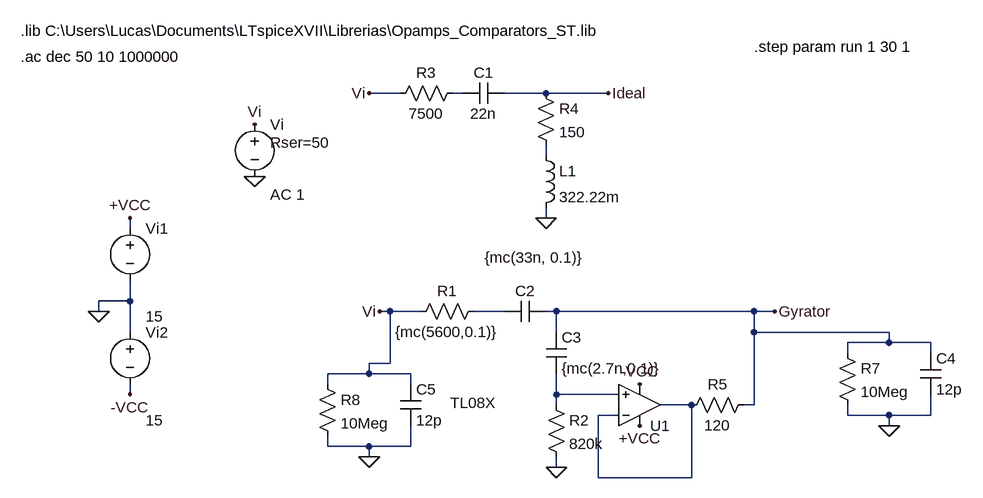
[diagram p0: schematic Pasaaltos.asc]
Pasaaltos.asc, the LTspice schematic file:
Version 4
SHEET 1 880 836
WIRE -96 144 -144 144
WIRE 0 144 -16 144
WIRE 128 144 64 144
WIRE 224 144 128 144
WIRE 128 240 128 224
WIRE 128 336 128 320
WIRE -512 352 -512 336
WIRE -512 464 -512 432
WIRE -512 464 -560 464
WIRE -560 480 -560 464
WIRE -112 480 -128 480
WIRE -64 480 -112 480
WIRE 64 480 16 480
WIRE 144 480 128 480
WIRE 448 480 144 480
WIRE 480 480 448 480
WIRE -512 512 -512 464
WIRE 144 512 144 480
WIRE 448 512 448 480
WIRE 656 512 448 512
WIRE 656 528 656 512
WIRE 656 528 592 528
WIRE 720 528 656 528
WIRE 592 544 592 528
WIRE 720 544 720 528
WIRE -112 560 -112 480
WIRE -112 560 -144 560
WIRE -144 576 -144 560
WIRE -144 576 -208 576
WIRE -80 576 -144 576
WIRE -208 592 -208 576
WIRE -80 592 -80 576
WIRE -512 608 -512 592
WIRE 144 608 144 576
WIRE 240 608 144 608
WIRE 144 624 144 608
WIRE 352 624 304 624
WIRE 448 624 448 512
WIRE 448 624 432 624
WIRE 240 640 208 640
WIRE 592 640 592 624
WIRE 656 640 592 640
WIRE 720 640 720 608
WIRE 720 640 656 640
WIRE 656 656 656 640
WIRE -208 688 -208 672
WIRE -144 688 -208 688
WIRE -80 688 -80 656
WIRE -80 688 -144 688
WIRE -144 704 -144 688
WIRE 144 720 144 704
WIRE 208 736 208 640
WIRE 352 736 352 624
WIRE 352 736 208 736
FLAG -320 192 Vi
FLAG -320 272 0
FLAG -512 336 +VCC
FLAG -512 608 -VCC
FLAG -560 480 0
FLAG 128 336 0
FLAG -144 144 Vi
FLAG 224 144 Ideal
FLAG -128 480 Vi
FLAG 144 720 0
FLAG 272 656 +VCC
FLAG 272 592 -VCC
FLAG 480 480 Gyrator
FLAG 656 656 0
FLAG -144 704 0
SYMBOL voltage -320 176 R0
WINDOW 123 24 124 Left 2
WINDOW 39 24 44 Left 2
SYMATTR Value2 AC 1
SYMATTR SpiceLine Rser=50
SYMATTR InstName Vi
SYMATTR Value ""
SYMBOL voltage -512 336 R0
WINDOW 3 24 152 Left 2
WINDOW 123 24 124 Left 2
WINDOW 39 0 0 Left 0
SYMATTR Value 15
SYMATTR InstName Vi1
SYMBOL voltage -512 496 R0
WINDOW 3 24 152 Left 2
WINDOW 123 24 124 Left 2
WINDOW 39 0 0 Left 0
SYMATTR Value 15
SYMATTR InstName Vi2
SYMBOL res 0 128 R90
WINDOW 0 0 56 VBottom 2
WINDOW 3 32 56 VTop 2
SYMATTR InstName R3
SYMATTR Value 7500
SYMBOL cap 64 128 R90
WINDOW 0 0 32 VBottom 2
WINDOW 3 32 32 VTop 2
SYMATTR InstName C1
SYMATTR Value 22n
SYMBOL res 112 128 R0
SYMATTR InstName R4
SYMATTR Value 150
SYMBOL ind 112 224 R0
SYMATTR InstName L1
SYMATTR Value 322.22m
SYMBOL cap 128 464 R90
WINDOW 0 0 32 VBottom 2
WINDOW 3 -83 18 VTop 2
SYMATTR InstName C2
SYMATTR Value {mc(33n, 0.1)}
SYMBOL cap 128 512 R0
SYMATTR InstName C3
SYMATTR Value {mc(2.7n,0.1)}
SYMBOL res 128 608 R0
SYMATTR InstName R2
SYMATTR Value 820k
SYMBOL Opamps\\opamp2 272 688 M180
WINDOW 3 -291 67 Left 2
SYMATTR Value TL08X
SYMATTR InstName U1
SYMBOL res 448 608 R90
WINDOW 0 0 56 VBottom 2
WINDOW 3 32 56 VTop 2
SYMATTR InstName R5
SYMATTR Value 120
SYMBOL res 32 464 R90
WINDOW 0 0 56 VBottom 2
WINDOW 3 32 56 VTop 2
SYMATTR InstName R1
SYMATTR Value {mc(5600,0.1)}
SYMBOL res 576 528 R0
SYMATTR InstName R7
SYMATTR Value 10Meg
SYMBOL cap 704 544 R0
SYMATTR InstName C4
SYMATTR Value 12p
SYMBOL res -224 576 R0
SYMATTR InstName R8
SYMATTR Value 10Meg
SYMBOL cap -96 592 R0
SYMATTR InstName C5
SYMATTR Value 12p
TEXT -680 88 Left 2 !.ac dec 50 10 1000000
TEXT -680 48 Left 2 !.lib C:\\Users\\Lucas\\Documents\\LTspiceXVII\\Librerias\\Opamps_Comparators_ST.lib
TEXT 448 72 Left 2 !.step param run 1 30 1

The netlist it stands for:
* Pasaaltos.asc
Vi Vi 0 AC 1 Rser=50
Vi1 +VCC 0 15
Vi2 0 -VCC 15
R3 N001 Vi 7500
C1 Ideal N001 22n
R4 Ideal N002 150
L1 N002 0 322.22m
C2 Gyrator N003 {mc(33n, 0.1)}
C3 Gyrator N004 {mc(2.7n,0.1)}
R2 N004 0 820k
XU1 N004 N005 +VCC -VCC N005 TL08X  ; pins In+ In- V+ V- OUT
R5 Gyrator N005 120
R1 N003 Vi {mc(5600,0.1)}
R7 Gyrator 0 10Meg
C4 Gyrator 0 12p
R8 Vi 0 10Meg
C5 Vi 0 12p
.ac dec 50 10 1000000
.lib C:\Users\Lucas\Documents\LTspiceXVII\Librerias\Opamps_Comparators_ST.lib
.step param run 1 30 1
.backanno
.end